# Altium schematic sheet HV-Measurement.SchDoc
size A4; SheetNumber: 6
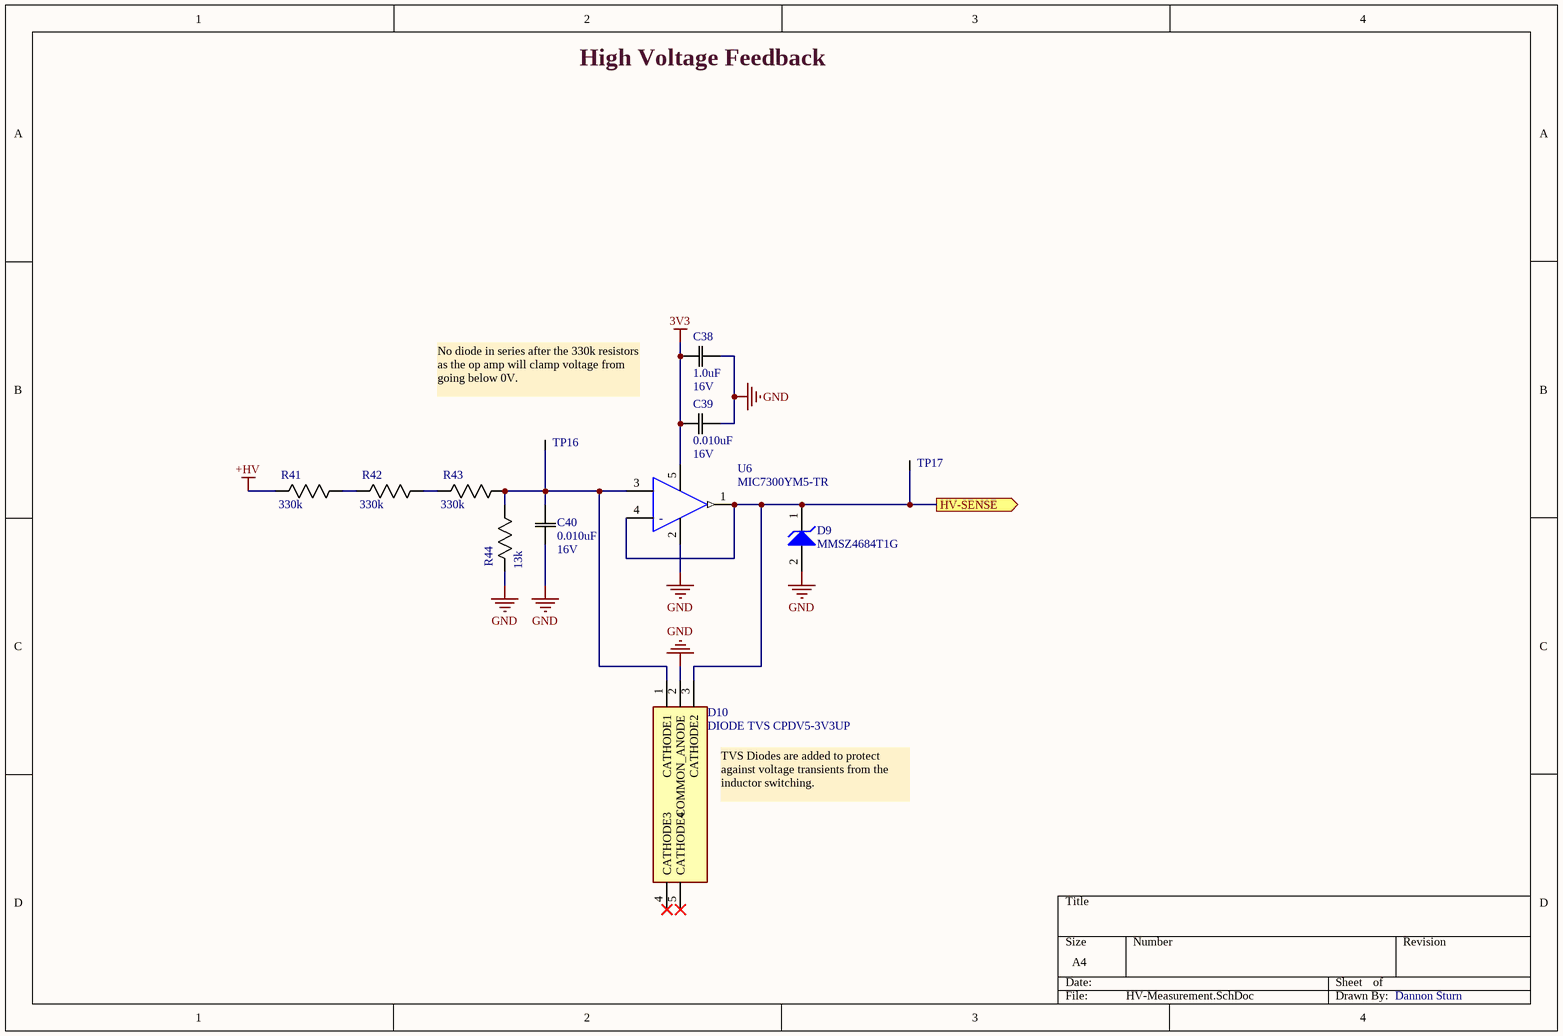
[diagram p0: HV-Measurement.SchDoc]

## Parts
C38  Rating: 16V  [0805]  (hidden comment: 1.0uF)
C39  Rating: 16V  [0805]  (hidden comment: 0.010uF)
C40  Rating: 16V  [0805]  (hidden comment: 0.010uF)
D9  MMSZ4684T1G  [ONSC-SOD-123-2-425-04_V]
D10  DIODE TVS CPDV5-3V3UP  [SOT65P230X110-5N]
R41  330k  [0805]
R42  330k  [0805]
R43  330k  [0805]
R44  13k  [0805]
TP16  Test Point (Via)  [TP]  (value not drawn)
TP17  Test Point (Via)  [TP]  (value not drawn)
U6  MIC7300YM5-TR  [FP-SOT23-5LD-PL-1-IPC_A]

## Ports
HV-SENSE (out)

## Nets
3V3: C38.2(C2) C39.1(C1) U6.5(V+)
+HV: R41.2(R2)
GND: C38.1(C1) C39.2(C2) C40.1(C1) D9.2(A) D10.2(COMMON_ANODE) R44.2(R2) U6.2(V-)
HV-SENSE: D9.1(K) D10.3(CATHODE2) TP17.1 U6.1(OUT) U6.4(IN-) ; port HV-SENSE
NetC40_2: C40.2(C2) D10.1(CATHODE1) R43.1(R1) R44.1(R1) TP16.1 U6.3(IN+)
NetR41_1: R41.1(R1) R42.2(R2)
NetR42_1: R42.1(R1) R43.2(R2)

Not connected (* = marked no-connect by the designer): D10 4(CATHODE3)* 5(CATHODE4)*

## Notes on the sheet
- High Voltage Feedback
- No diode in series after the 330k resistors as the op amp will clamp voltage from going below 0V.
- (near D10) TVS Diodes are added to protect against voltage transients from the inductor switching.
- Dannon Sturn
- (in symbol OP AMP MIC7300YM5-TR) -

## Library data of the parts
C38 = CAP 1.0uF 16V: CAP CER 1.0UF 16V X5R 0603/0805; Tolerance: 10%; Package: 0603/0805; Temperature Coefficient: X5R; Operating Temperature: -55°C ~ 85°C; Value: 1.0uF
C39 C40 = CAP 0.010uF 16V: CAP CER 0.010UF 16V X5R 0603/0805; Tolerance: 10%; Package: 0603/0805; Temperature Coefficient: X5R; Operating Temperature: -55°C ~ 85°C; Value: 0.010uF
D9 = DIODE ZENER 3.3 500mW: Zener 3V3 Voltage Regulator, 500 mW, 2-Pin SOD-123, Pb-Free, Tape and Reel; Manufacturer: On Semiconductor; P Max (W): 0.5; VZ Typ (V): 3.3; ComponentLink2URL: http://www.onsemi.com/pub_link/Collateral/MMSZ4678T1-D.PDF; ComponentLink1URL: http://www.onsemi.com/; PartNumber: MMSZ4684T1G; ComponentLink2Description: Datasheet; ComponentLink3URL: http://www.onsemi.com/pub_link/Collateral/425-04.PDF; DatasheetVersion: Rev. 9; ComponentLink1Description: Manufacturer URL; RoHS: Pb-Free; ComponentLink3Description: Package Specification; PackageReference: SOD-123-2-425-04; PackageVersion: Rev. G, 10/2009; Mounting Technology: Surface Mount; Packing: Tape and Reel; PackageDescription: 2-Pin SOD, Body 1.6 x 2.69 mm; Supplier 1: Digi-Key; Supplier Part Number 1: MMSZ4684T1GOSCT-ND
D10 = DIODE TVS CPDV5-3V3UP: TVS Diode Bidirectional Vbr = 3.5V, Working Voltage = 3.3V; Manufacturer_Name: Comchip Technology; Datasheet Link: http://www.comchiptech.com/admin/files/product/CPDV5-3V3UP-HF%20RevB181493.pdf; Height: 1.1mm; Manufacturer_Part_Number: CPDV5-3V3UP; Arrow Part Number: CPDV5-3V3UP; Arrow Price/Stock: https://www.arrow.com/en/products/cpdv5-3v3up/comchip-technology; Mouser Part Number: 750-CPDV5-3V3UP; Mouser Price/Stock: https://www.mouser.com/Search/Refine.aspx?Keyword=750-CPDV5-3V3UP; Supplier 1: Digi-Key; Supplier Part Number 1: 641-1422-1-ND
R41-R43 = RES 330k 1/8W - 5%: RES SMD 330K OHM 5% 1/8W 0805; Power (Watts): 0.125W; Package: 0805; Value: 330k; Tolerance: 5%
R44 = RES 13k 1/8W: RES SMD 13K OHM 5% 1/8W 0805; Power (Watts): 0.125W; Package: 0805; Value: 13k; Tolerance: 5%
U6 = OP AMP MIC7300YM5-TR: IC OPAMP GP 1 CIRCUIT SOT23-5; Manufacturer: Microchip; Voltage Gain: 300-340V/mV; Gain Bandwidth: 0.55MHz; Min Supply Voltage: 2.2V; Max Junction Temp: +85°C; Input Bias Current: 0.0000005uA; Number Of Channels: 1; Input Offset Voltage: 1mV; Nominal Supply Current: 0.7-1.5mA; Max Supply Voltage: 10V; Standoff Height: 0mm; Mouser Description: Operational Amplifiers - Op Amps; Height: 1.45mm; Footprint Url: https://ww1.microchip.com/downloads/en/PackagingSpec/00000049CH.pdf; Temperature: -40°C to +85°C; Package: SOT23-5LD-PL-1; Automotive: No; Temperature Range High: +85°C; ComponentLink2URL: http://www.microchip.com/mymicrochip/filehandler.aspx?ddocname=en580613; Device Class L2: Linear ICs; Lead Free: Yes; ComponentLink2Description: Datasheet; Digikey Description: IC OPAMP GP 1 CIRCUIT SOT23-5; Device Class L3: Amplifiers - Op Amps; Manufacturer Part Number: MIC7300YM5-TR; Temperature Range Low: -40°C; Category: IC; RoHS: TRUE; Octopart: https://octopart.com/mic7300ym5-tr-microchip-66803593; Device Class L1: Integrated Circuits (ICs); Supplier 1: Digi-Key; Supplier Part Number 1: 576-1319-1-ND